# EAGLE design ecg (EAGLE 9.3.0)

## Sheet 1 of 3
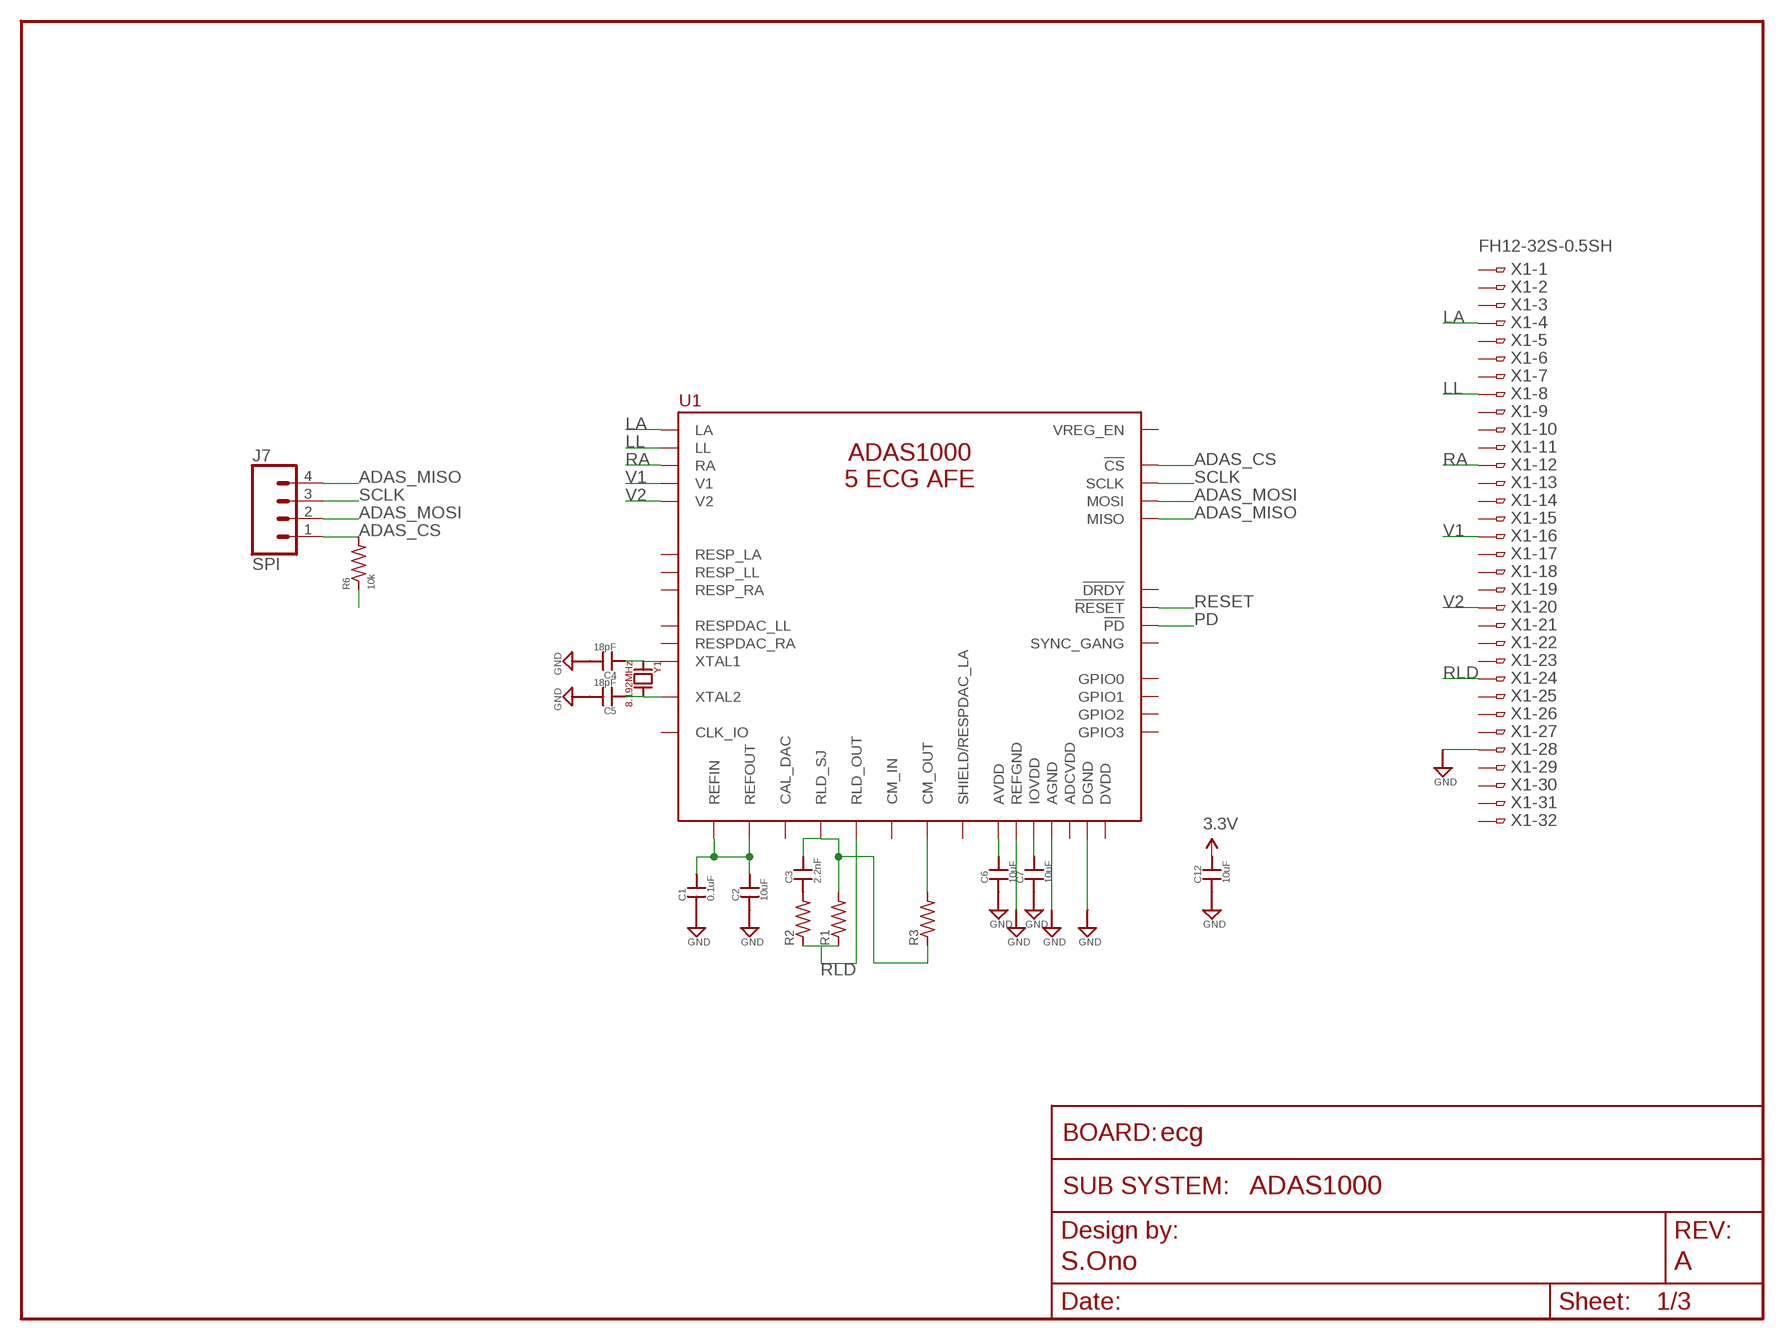
[diagram p0: schematic, sheet 1]
FRAME1 (FRAME_SCHEMATIC): AUTHOR: S.Ono; REV: A; SUBSYSTEM_NAME: ADAS1000

### Parts
C1  0.1uF  CAP0603-CAP  [0603-CAP]
C2  10uF  CAP0603-CAP  [0603-CAP]
C3  2.2nF  CAP0603-CAP  [0603-CAP]
C4  18pF  CAP0603-CAP  [0603-CAP]
C5  18pF  CAP0603-CAP  [0603-CAP]
C6  10uF  CAP0603-CAP  [0603-CAP]
C7  10uF  CAP0603-CAP  [0603-CAP]
C12  10uF  CAP0603-CAP  [0603-CAP]
J7  SPI  CONN_04  [1X04]
R1  4M  R-US_R0603  [R0603]
R2  100k  R-US_R0603  [R0603]
R3  40k  R-US_R0603  [R0603]
R6  10k  R-US_R0603  [R0603]
U1  ADAS1000  [QFP50P1200X1200X160-65N]
X1  FH12-32S-0.5SH  [FH12-32S-0.5SH]
Y1  8.192MHz  CRYSTAL  [HC-49]

### Nets
3.3V: C6.2 C7.2 C12.2 R6.1 U1.18(AVDD) U1.23(AVDD) U1.35(IOVDD) U1.46(IOVDD) U1.58(AVDD) U1.63(AVDD) ; also sheet 2,3
ADAS_CS: J7.1 R6.2 U1.41(!CS) ; also sheet 3
ADAS_MISO: J7.4 U1.45(MISO) ; also sheet 3
ADAS_MOSI: J7.2 U1.43(MOSI) ; also sheet 3
GND: C1.1 C2.1 C4.2 C5.2 C6.1 C7.1 C12.1 U1.2(AGND) U1.7(REFGND) U1.15(AGND) U1.24(AGND) U1.25(AGND) U1.31(DGND) U1.34(DGND) U1.40(DGND) U1.47(DGND) U1.50(DGND) U1.56(AGND) U1.57(AGND) X1.28 ; also sheet 2,3
LA: U1.10(LA) X1.4
LL: U1.11(LL) X1.8
N$1: C1.2 C2.2 U1.8(REFOUT) U1.9(REFIN)
N$3: C3.2 R1.2 R3.1 U1.21(RLD_SJ)
N$4: C3.1 R2.2
N$5: R3.2 U1.22(CM_OUT)
N$6: C4.1 U1.27(XTAL1) Y1.A
N$7: C5.1 U1.28(XTAL2) Y1.B
PD: U1.53(!PD)
RA: U1.12(RA) X1.12
RESET: U1.54(!RESET)
RLD: R1.1 R2.1 U1.20(RLD_OUT) X1.24
SCLK: J7.3 U1.44(SCLK) ; also sheet 3
V1: U1.13(V1) X1.16
V2: U1.14(V2) X1.20
Unconnected: U1.3(RESPDAC_RA) U1.4(RESP_RA) U1.5(RESP_LL) U1.6(RESP_LA) U1.19(CM_IN) U1.26(ADCVDD) U1.29(CLK_IO) U1.30(DVDD) U1.36(GPIO0) U1.37(GPIO1) U1.38(GPIO2) U1.39(GPIO3) U1.42(!DRDY) U1.51(DVDD) U1.52(SYNC_GANG) U1.55(ADCVDD) U1.59(VREG_EN) U1.60(SHIELD/RESPDAC_LA) U1.61(CAL_DAC) U1.62(RESPDAC_LL) X1.1 X1.2 X1.3 X1.5 X1.6 X1.7 X1.9 X1.10 X1.11 X1.13 X1.14 X1.15 X1.17 X1.18 X1.19 X1.21 X1.22 X1.23 X1.25 X1.26 X1.27 X1.29 X1.30 X1.31 X1.32

## Sheet 2 of 3
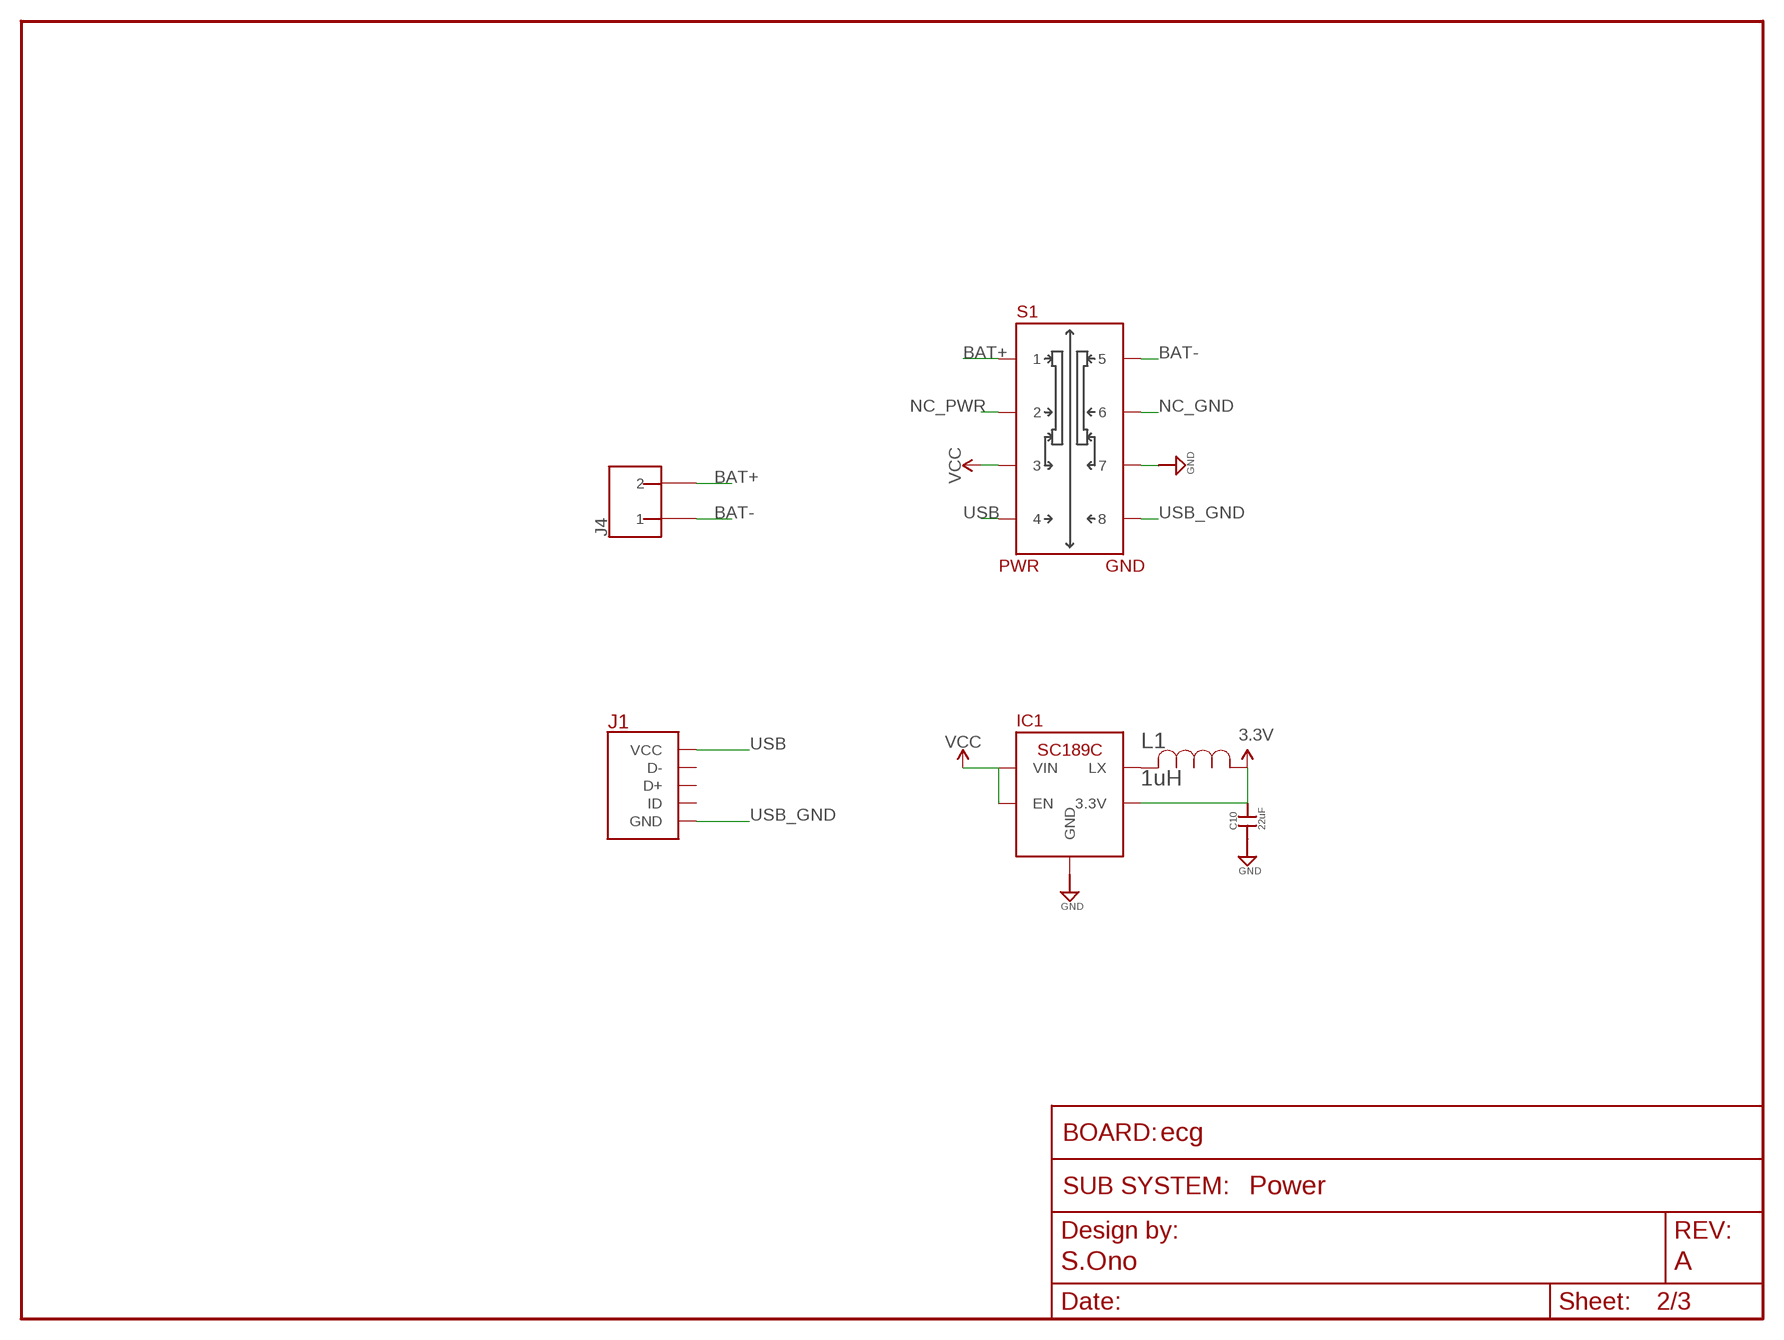
[diagram p1: schematic, sheet 2]
FRAME2 (FRAME_SCHEMATIC): AUTHOR: S.Ono; REV: A; SUBSYSTEM_NAME: Power

### Parts
C10  22uF  CAP0603-CAP  [0603-CAP]
IC1  SC189C  [SOT23-5]
J1  USB_MICRO  [USB_MICRO]
J4  2_PIN_JST-XH  [2_PIN_JST-XH]
L1  1uH  IND  [IND_2012]
S1  DP3T  [DP3T]

### Nets
3.3V: C10.2 IC1.4(3.3V) L1.1 ; also sheet 1,3
BAT+: J4.P$2 S1.1
BAT-: J4.P$1 S1.5
GND: C10.1 IC1.2(GND) S1.7 ; also sheet 1,3
N$2: IC1.5(LX) L1.2
NC_GND: S1.6
NC_PWR: S1.2
USB: J1.VCC S1.4
USB_GND: J1.GND S1.8
VCC: IC1.1(VIN) IC1.3(EN) S1.3
Unconnected: J1.D+ J1.D- J1.ID

### Notes on the sheet
- PWR | GND

## Sheet 3 of 3
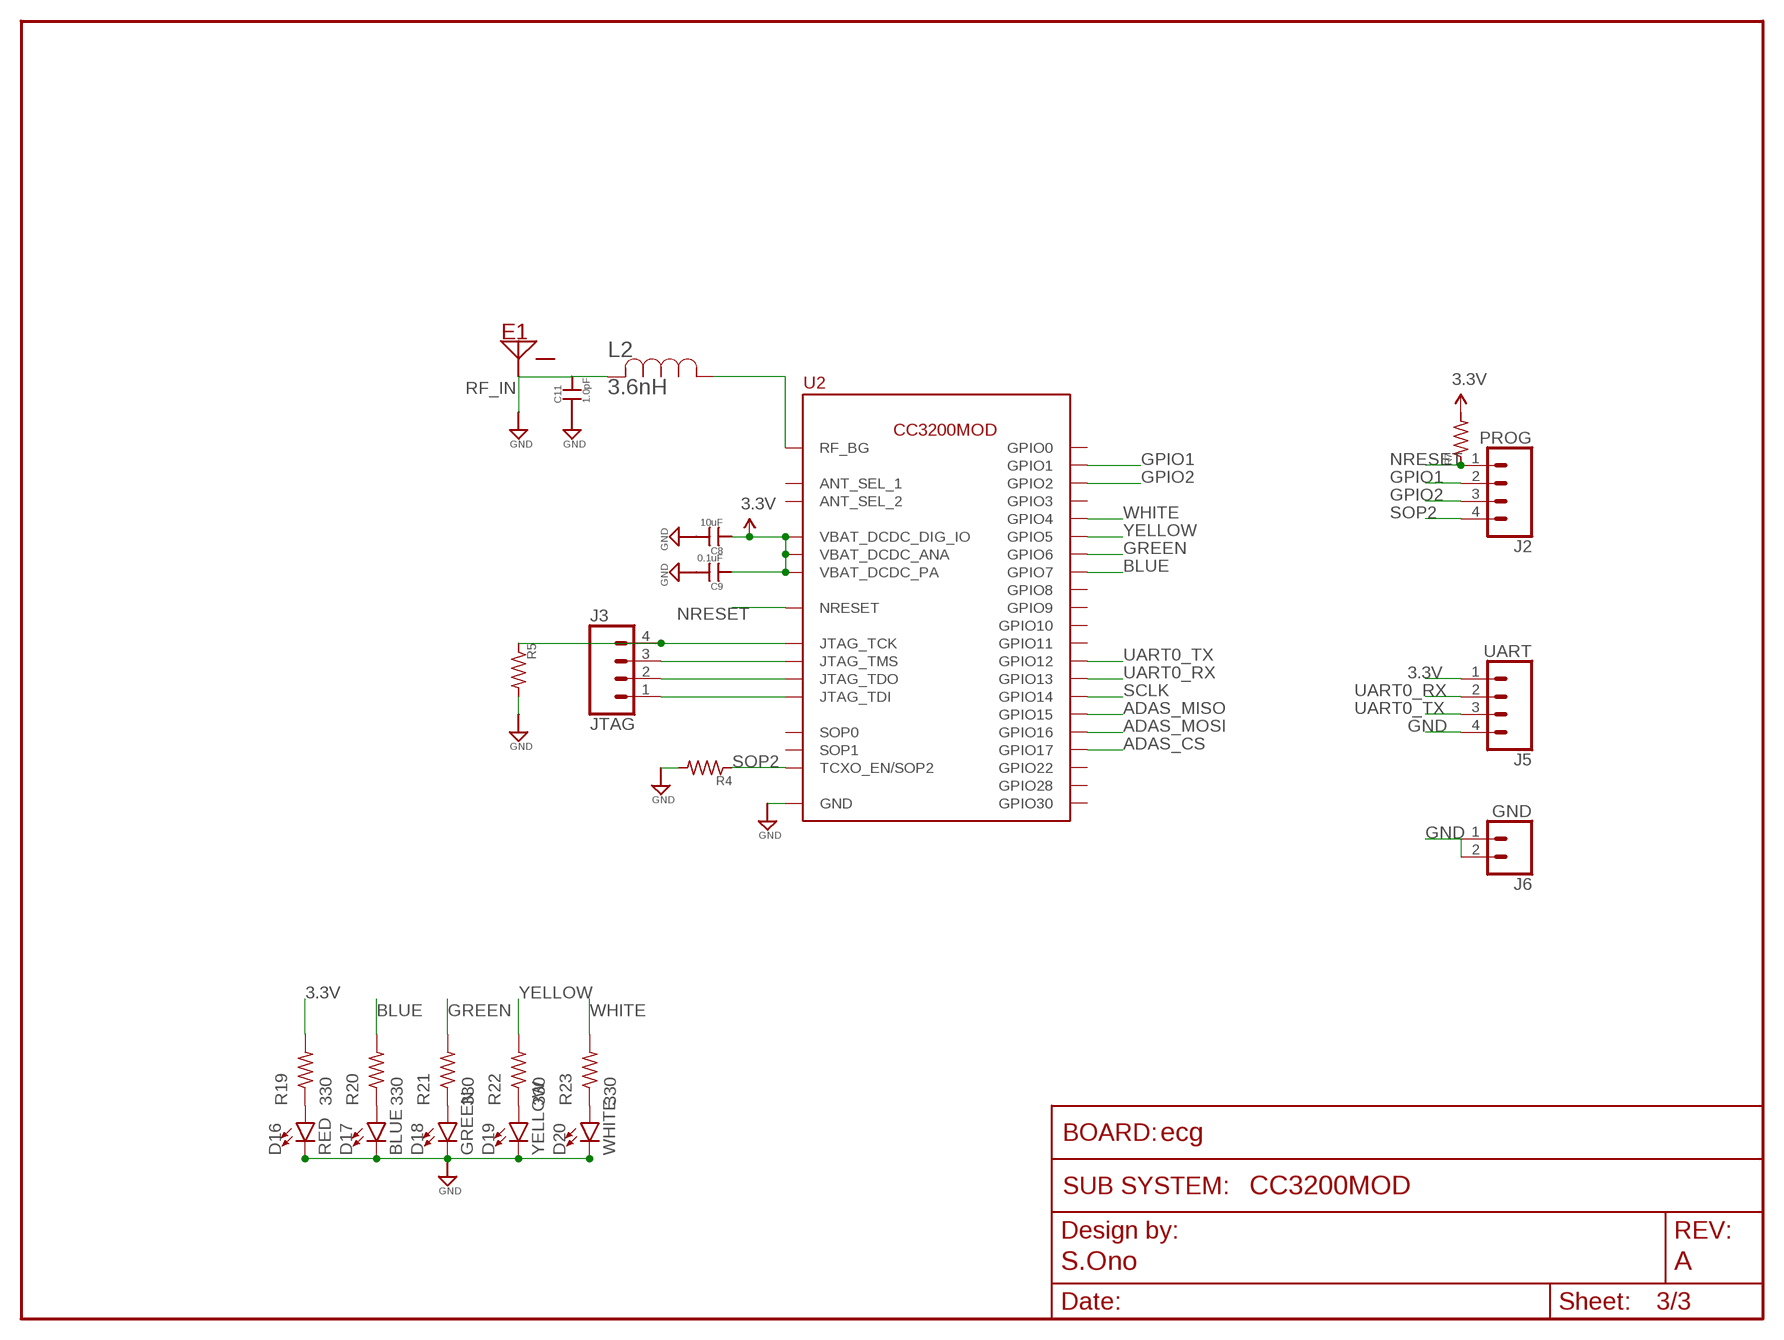
[diagram p2: schematic, sheet 3]
FRAME3 (FRAME_SCHEMATIC): AUTHOR: S.Ono; REV: A; SUBSYSTEM_NAME: CC3200MOD

### Parts
C8  10uF  CAP0603-CAP  [0603-CAP]
C9  0.1uF  CAP0603-CAP  [0603-CAP]
C11  1.0pF  CAP0603-CAP  [0603-CAP]
D16  RED  LED0603  [LED-0603]
D17  BLUE  LED0603  [LED-0603]
D18  GREEN  LED0603  [LED-0603]
D19  YELLOW  LED0603  [LED-0603]
D20  WHITE  LED0603  [LED-0603]
E1  AH316M245001-T  [CHIP_ANT]
J2  PROG  CONN_04  [1X04]
J3  JTAG  CONN_04  [1X04]
J5  UART  CONN_04  [1X04]
J6  GND  CONN_02  [1X02]
L2  3.6nH  IND0402  [IND0402_22N_TAI]
R4  2.7k  R-US_R0603  [R0603]
R5  100k  R-US_R0603  [R0603]
R7  R-US_R0603  [R0603]
R19  330  R-US_R0402  [R0402]
R20  330  R-US_R0402  [R0402]
R21  330  R-US_R0402  [R0402]
R22  330  R-US_R0402  [R0402]
R23  330  R-US_R0402  [R0402]
U2  CC3200MOD  [63-SMD]

### Nets
3.3V: C8.1 C9.1 J5.1 R7.2 R19.2 U2.P$36(VBAT_DCDC_ANA) U2.P$37(VBAT_DCDC_PA) U2.P$40(VBAT_DCDC_DIG_IO) ; also sheet 1,2
ADAS_CS: U2.P$8(GPIO17) ; also sheet 1
ADAS_MISO: U2.P$6(GPIO15) ; also sheet 1
ADAS_MOSI: U2.P$7(GPIO16) ; also sheet 1
BLUE: R20.2 U2.P$52(GPIO7)
GND: C8.2 C9.2 C11.1 D16.C D17.C D18.C D19.C D20.C J5.4 J6.1 J6.2 R4.2 R5.2 U2.P$1(GND) U2.P$2(GND) U2.P$16(GND) U2.P$27(GND) U2.P$28(GND) U2.P$30(GND) U2.P$32(GND) U2.P$38(GND) U2.P$43(GND) U2.P$55(GND) U2.P$56(GND) U2.P$57(GND) U2.P$58(GND) U2.P$59(GND) U2.P$60(GND) U2.P$61(GND) U2.P$62(GND) U2.P$63(GND) ; also sheet 1,2
GPIO1: J2.2 U2.P$46(GPIO1)
GPIO2: J2.3 U2.P$47(GPIO2)
GREEN: R21.2 U2.P$51(GPIO6)
N$8: J3.4 R5.1 U2.P$21(JTAG_TCK)
N$9: J3.3 U2.P$22(JTAG_TMS)
N$10: J3.2 U2.P$18(JTAG_TDO)
N$11: J3.1 U2.P$12(JTAG_TDI)
N$24: D16.A R19.1
N$25: D17.A R20.1
N$26: D18.A R21.1
N$27: D19.A R22.1
N$28: D20.A R23.1
NRESET: J2.1 R7.1 U2.P$35(NRESET)
RF_BG: L2.1 U2.P$31(RF_BG)
RF_IN: C11.2 E1.INPUT L2.2 ; supply symbol labelled GND
SCLK: U2.P$5(GPIO14) ; also sheet 1
SOP2: J2.4 R4.1 U2.P$23(TCXO_EN/SOP2)
UART0_RX: J5.2 U2.P$10(GPIO13)
UART0_TX: J5.3 U2.P$9(GPIO12)
WHITE: R23.2 U2.P$49(GPIO4)
YELLOW: R22.2 U2.P$50(GPIO5)
Unconnected: E1.GND U2.P$3(GPIO10) U2.P$4(GPIO11) U2.P$11(GPIO22) U2.P$19(GPIO28) U2.P$24(SOP1) U2.P$25(ANT_SEL_1) U2.P$26(ANT_SEL_2) U2.P$34(SOP0) U2.P$42(GPIO30) U2.P$44(GPIO0) U2.P$48(GPIO3) U2.P$53(GPIO8) U2.P$54(GPIO9)

## Library data of the parts
C1-C12 = scono:CAP: Capacitor Standard 0603 ceramic capacitor, and 0.1" leaded capacitor.; PIE-INT-REF-NUM: CAPACITOR-GENERIC
D16-D20 = scono:LED: https://www.digikey.com/products/en/optoelectronics/led-indication-discrete/105?k=&pkeyword=&pv7=2&pv1989=0&pv16=5&FV=ffe00069&quantity=0&ColumnSort=0&page=1&pageSize=25
E1 = scono:AH316M245001-T: https://www.digikey.com/product-detail/en/taiyo-yuden/AH316M245001-T/587-2200-1-ND/2002898
IC1 = scono:SC189C: https://www.digikey.com/product-detail/en/semtech-corporation/SC189ZSKTRT/SC189ZSKCT-ND/2182343
J1 = scono:USB_MICRO: https://www.digikey.com/product-detail/en/molex-llc/0475890001/WM17143CT-ND/1832255
J2 J3 J5 J7 = scono:CONN_04: Multi connection point. Often used as Generic Header-pin footprint for 0.1 inch spaced/style header connections On any of the 0.1 inch spaced packages, you can populate with these: Break Away Headers - Straight <https://www.sparkfun.com/products/116> (PRT-00116) Break Away Male Headers - Right Angle <https://www.sparkfun.com/products/553> (PRT-00553) Female Headers <https://www.sparkfun.com/products/115> (PRT-00115) Break Away Headers - Machine Pin <https://www.sparkfun.com/products/117> (PRT-00117) Break Away Female Headers - Swiss Machine Pin <https://www.sparkfun.com/products/743> (PRT-00743) For SCREWTERMINALS and SPRING TERMINALS visit here: Screw Terimnals on SparkFun.com <https://www.sparkfun.com/search/results?term=Screw+Terminals> (5mm/3.5mm/2.54mm spacing) This device is also useful as a general connection point to wire up your design to another part of your project. Our various solder wires solder well into these plated through hole pads. Hook-Up Wire - Assortment (Stranded, 22 AWG) <https://www.sparkfun.com/products/11375> (PRT-11375) Hook-Up Wire - Assortment (Solid Core, 22 AWG) <https://www.sparkfun.com/products/11367> (PRT-11367) View the entire wire category on our website here <https://www.sparkfun.com/categories/141> Special notes: Molex polarized connector foot print use with SKU : PRT-08231 with associated crimp pins and housings. 1MM SMD Version SKU: PRT-10208; PROD_ID: CONN-09696
J4 = scono:2_PIN_JST-XH: https://www.digikey.com/product-detail/en/jst-sales-america-inc/B2B-XH-A(LF)(SN)/455-2247-ND/1651045
J6 = scono:CONN_02: Multi connection point. Often used as Generic Header-pin footprint for 0.1 inch spaced/style header connections On any of the 0.1 inch spaced packages, you can populate with these: Break Away Headers - Straight <https://www.sparkfun.com/products/116> (PRT-00116) Break Away Male Headers - Right Angle <https://www.sparkfun.com/products/553> (PRT-00553) Female Headers <https://www.sparkfun.com/products/115> (PRT-00115) Break Away Headers - Machine Pin <https://www.sparkfun.com/products/117> (PRT-00117) Break Away Female Headers - Swiss Machine Pin <https://www.sparkfun.com/products/743> (PRT-00743) For SCREWTERMINALS and SPRING TERMINALS visit here: Screw Terimnals on SparkFun.com <https://www.sparkfun.com/search/results?term=Screw+Terminals> (5mm/3.5mm/2.54mm spacing) This device is also useful as a general connection point to wire up your design to another part of your project. Our various solder wires solder well into these plated through hole pads. Hook-Up Wire - Assortment (Stranded, 22 AWG) <https://www.sparkfun.com/products/11375> (PRT-11375) Hook-Up Wire - Assortment (Solid Core, 22 AWG) <https://www.sparkfun.com/products/11367> (PRT-11367) View the entire wire category on our website here <https://www.sparkfun.com/categories/141> Special notes: Molex polarized connector foot print use with: PRT-08233 with associated crimp pins and housings. 2.54_SCREWTERM for use with PRT-10571. 3.5mm Screw Terminal footprints for PRT-08084 5mm Screw Terminal footprints for use with PRT-08432
L1 = scono:IND; MANUFACTURER_PART_NUMBER: MLZ2012M1R0HT000; VENDOR: TDK
L2 = scono:IND
R1-R7 = scono:R-US_: RESISTOR, American symbol; DESCRIPTION: RESISTOR, American symbol; DISTRIBUTOR: DigiKey; MANUFACTURER: Rohm Semiconductor; NOTES: Cut Tape; PACKAGE: R0603
R19-R23 = BEST_Custom:R-US_: RESISTOR, American symbol; PIE-INT-REF-NUM: RESISTOR-GENERIC
S1 = scono:DP3T: https://www.digikey.com/product-detail/en/c-k/JS203011JCQN/CKN10725CT-ND/6137639
U1 = scono:ADAS1000: http://www.analog.com/media/en/reference-design-documentation/reference-designs/CN0308.pdf
U2 = scono:CC3200MOD: https://www.digikey.com/product-detail/en/CC3200MODR1M2AMOBT/296-43564-1-ND/5864711?utm_campaign=buynow&WT.z_cid=ref_octopart_dkc_buynow&utm_medium=aggregator&curr=usd&site=us&utm_source=octopart
X1 = scono:FH12-32S-0.5S: 0.5mm Pitch Connectors For FPC/FFC Source: Data sheet <http://www.hirose.co.jp/cataloge_hp/e58605370.pdf>; OC_FARNELL: unknown; OC_NEWARK: unknown
Y1 = scono:CRYSTAL

## Board
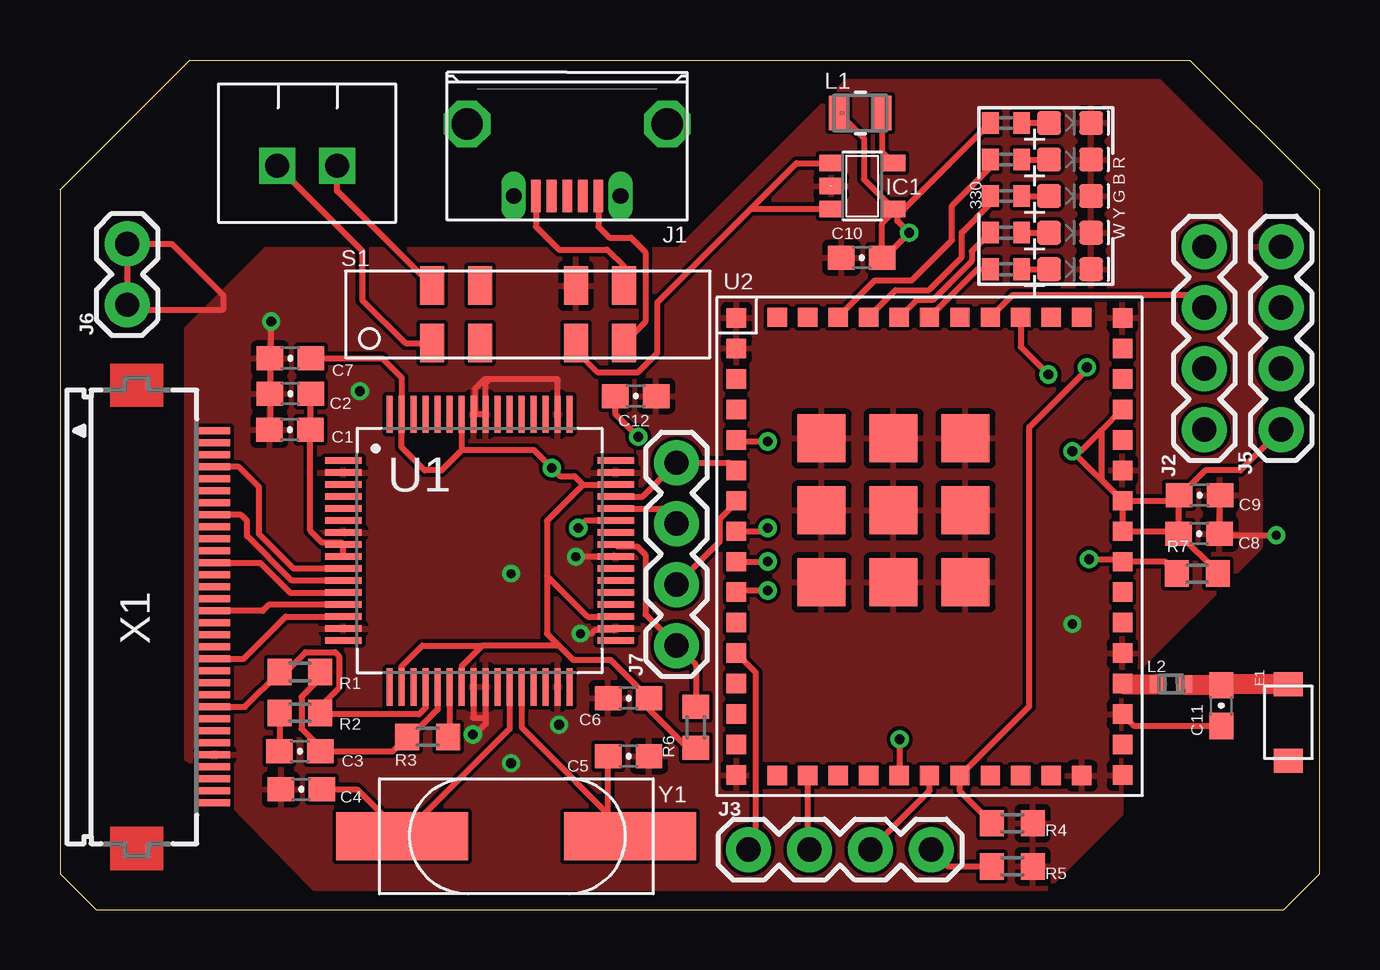
[diagram p3: board, top side]
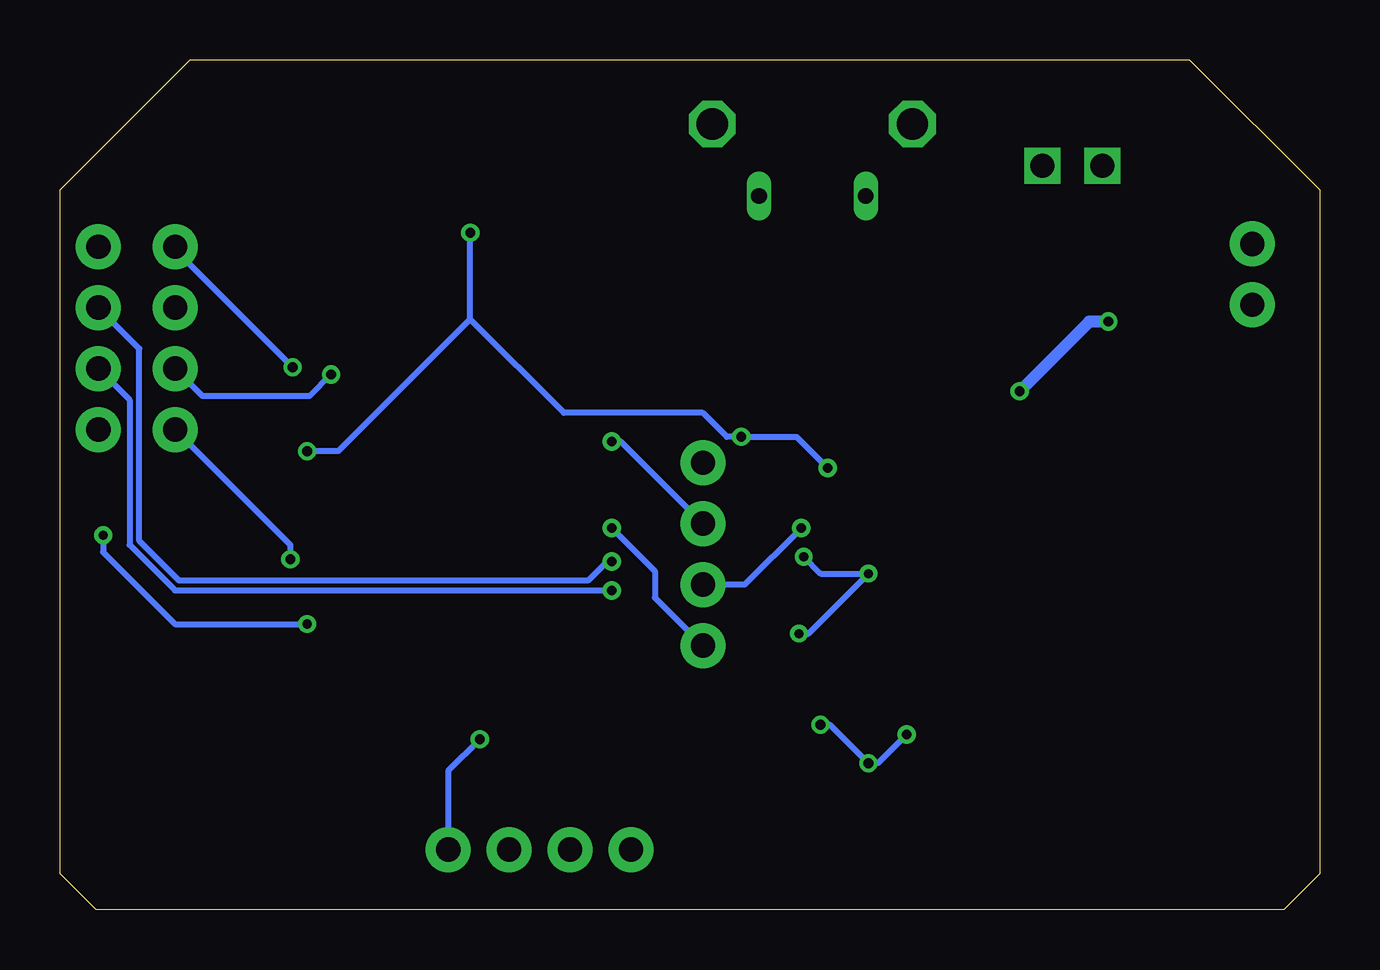
[diagram p4: board, bottom side, seen from below]

Size 52.5 x 35.4 mm. Coordinates in mm from the lower left corner, seen from the top.
Outline: 0,1.5 1.5,0 51,0 52.5,1.5 52.5,30 47.1,35.4 5.4,35.4 0,30 0,1.5
Copper layers (1+16): Top 2mil / dielectric 9mil / Bottom 2mil
Design rules "squishy *": minimum track width 6mil, minimum drill 15mil, track to track 6mil, track to pad 6mil, pad to pad 6mil, via to via 6mil, smd to smd 6mil, copper to edge 25mil, drill to drill 7mil, minimum pad ring 7mil, minimum via ring 7mil, stop-mask expansion 3mil, vias tented up to drill 0mil, thermal gap 10mil

### Footprints (pad centres in the part's own frame; a part is rotated, then mirrored left to right if it is on the bottom)
0603-CAP = smd 1.1 x 1: 1 -0.85,0; 2 0.85,0
LED-0603 = smd 1 x 1: A -0.877,0; C 0.877,0
CHIP_ANT = smd 1 x 1.2: GND 1.6,0; INPUT -1.6,0
SOT23-5 = smd 0.69 x 0.99: 1 -0.95,-1.29; 2 0,-1.29; 3 0.95,-1.29; 4 0.95,1.3; 5 -0.95,1.3
USB_MICRO = smd 0.4 x 1.35: D+ 0,3; D- -0.65,3; GND 1.3,3; ID 0.65,3; VCC -1.3,3 | drill 1.3 octagon: P$1 -4.175,0; P$2 4.175,0 | drill 0.65 pad 1.016 long: P$3 -2.225,3; P$4 2.225,3
1X04 = drill 1.016 pad 1.88: 1 0,0; 2 2.54,0; 3 5.08,0; 4 7.62,0
2_PIN_JST-XH = drill 1 square: P$1 2.45,3.4; P$2 4.95,3.4
1X02 = drill 1.016 pad 1.88: 1 0,0; 2 2.54,0
IND_2012 = smd 0.803 x 1.45: 1 -0.902,0; 2 0.902,0
IND0402_22N_TAI = smd 0.61 x 0.711: 1 -0.572,0; 2 0.572,0
R0603 = smd 1 x 1.1: 1 -0.85,0; 2 0.85,0
R0402 = smd 0.7 x 0.9: 1 -0.65,0; 2 0.65,0
DP3T = smd 1 x 1.6: 1 -4,-1.2; 2 -2,-1.2; 3 2,-1.2; 4 4,-1.2; 5 -4,1.2; 6 -2,1.2; 7 2,1.2; 8 4,1.2
QFP50P1200X1200X160-65N = smd 1.56 x 0.28: 1 -5.68,3.75; 2 -5.68,3.25; 3 -5.68,2.75; 4 -5.68,2.25; 5 -5.68,1.75; 6 -5.68,1.25; 7 -5.68,0.75; 8 -5.68,0.25; 9 -5.68,-0.25; 10 -5.68,-0.75; 11 -5.68,-1.25; 12 -5.68,-1.75; 13 -5.68,-2.25; 14 -5.68,-2.75; 15 -5.68,-3.25; 16 -5.68,-3.75; 33 5.68,-3.75; 34 5.68,-3.25; 35 5.68,-2.75; 36 5.68,-2.25; 37 5.68,-1.75; 38 5.68,-1.25; 39 5.68,-0.75; 40 5.68,-0.25; 41 5.68,0.25; 42 5.68,0.75; 43 5.68,1.25; 44 5.68,1.75; 45 5.68,2.25; 46 5.68,2.75; 47 5.68,3.25; 48 5.68,3.75 | smd 0.28 x 1.56: 17 -3.75,-5.68; 18 -3.25,-5.68; 19 -2.75,-5.68; 20 -2.25,-5.68; 21 -1.75,-5.68; 22 -1.25,-5.68; 23 -0.75,-5.68; 24 -0.25,-5.68; 25 0.25,-5.68; 26 0.75,-5.68; 27 1.25,-5.68; 28 1.75,-5.68; 29 2.25,-5.68; 30 2.75,-5.68; 31 3.25,-5.68; 32 3.75,-5.68; 49 3.75,5.68; 50 3.25,5.68; 51 2.75,5.68; 52 2.25,5.68; 53 1.75,5.68; 54 1.25,5.68; 55 0.75,5.68; 56 0.25,5.68; 57 -0.25,5.68; 58 -0.75,5.68; 59 -1.25,5.68; 60 -1.75,5.68; 61 -2.25,5.68; 62 -2.75,5.68; 63 -3.25,5.68; 64 -3.75,5.68
63-SMD = smd 0.81 x 0.81: P$1 -8.05,9.525; P$2 -8.05,8.255; P$3 -8.05,6.985; P$4 -8.05,5.715; P$5 -8.05,4.445; P$6 -8.05,3.175; P$7 -8.05,1.905; P$8 -8.05,0.635; P$9 -8.05,-0.635; P$10 -8.05,-1.905; P$11 -8.05,-3.175; P$12 -8.05,-4.445; P$13 -8.05,-5.715; P$14 -8.05,-6.985; P$15 -8.05,-8.255; P$16 -8.05,-9.525; P$17 -6.35,-9.55; P$18 -5.08,-9.55; P$19 -3.81,-9.55; P$20 -2.54,-9.55; P$21 -1.27,-9.55; P$22 0,-9.55; P$23 1.27,-9.55; P$24 2.54,-9.55; P$25 3.81,-9.55; P$26 5.08,-9.55; P$27 6.35,-9.55; P$28 8.05,-9.525; P$29 8.05,-8.255; P$30 8.05,-6.985; P$31 8.05,-5.715; P$32 8.05,-4.445; P$33 8.05,-3.175; P$34 8.05,-1.905; P$35 8.05,-0.635; P$36 8.05,0.635; P$37 8.05,1.905; P$38 8.05,3.175; P$39 8.05,4.445; P$40 8.05,5.715; P$41 8.05,6.985; P$42 8.05,8.255; P$43 8.05,9.525; P$44 6.35,9.55; P$45 5.08,9.55; P$46 3.81,9.55; P$47 2.54,9.55; P$48 1.27,9.55; P$49 0,9.55; P$50 -1.27,9.55; P$51 -2.54,9.55; P$52 -3.81,9.55; P$53 -5.08,9.55; P$54 -6.35,9.55 | smd 2 x 2: P$55 -4.5,4.5; P$56 -4.5,1.5; P$57 -4.5,-1.5; P$58 -1.5,4.5; P$59 -1.5,1.5; P$60 -1.5,-1.5; P$61 1.5,4.5; P$62 1.5,1.5; P$63 1.5,-1.5
FH12-32S-0.5SH = smd 0.3 x 1.3: 1 -7.75,3.25; 2 -7.25,3.25; 3 -6.75,3.25; 4 -6.25,3.25; 5 -5.75,3.25; 6 -5.25,3.25; 7 -4.75,3.25; 8 -4.25,3.25; 9 -3.75,3.25; 10 -3.25,3.25; 11 -2.75,3.25; 12 -2.25,3.25; 13 -1.75,3.25; 14 -1.25,3.25; 15 -0.75,3.25; 16 -0.25,3.25; 17 0.25,3.25; 18 0.75,3.25; 19 1.25,3.25; 20 1.75,3.25; 21 2.25,3.25; 22 2.75,3.25; 23 3.25,3.25; 24 3.75,3.25; 25 4.25,3.25; 26 4.75,3.25; 27 5.25,3.25; 28 5.75,3.25; 29 6.25,3.25; 30 6.75,3.25; 31 7.25,3.25; 32 7.75,3.25
HC-49 = smd 5.5 x 2: A 4.75,0; B -4.75,0

### Placement (x,y rotation side)
C1  9.58,19.99 0 top
C2  9.6,21.49 0 top
C3  10,6.59 0 top
C4  10.06,5.01 180 top
C5  23.7,6.39 0 top
C6  23.7,8.81 0 top
C7  9.6,22.97 0 top
C8  47.48,15.67 0 top
C9  47.5,17.27 0 top
C10  33.42,27.17 0 top
C11  48.4,8.5 90 top
C12  24,21.4 180 top
D16  42.1,32.78 0 top
D17  42.1,31.25 0 top
D18  42.1,29.73 0 top
D19  42.1,28.21 0 top
D20  42.1,26.68 0 top
E1  51.2,7.8 270 top
IC1  33.44,30.15 270 top
J1  21.14,32.73 180 top
J2  47.7,20 90 top
J3  28.7,2.5 0 top
J4  14,34.4 180 top
J5  50.9,20 90 top
J6  2.8,25.2 90 top
J7  25.7,11 90 top
L1  33.36,33.19 0 top
L2  46.3,9.4 0 top
R1  10,9.9 0 top
R2  10,8.2 180 top
R3  15.32,7.2 0 top
R4  39.7,3.6 0 top
R5  39.7,1.8 0 top
R6  26.5,7.6 90 top
R7  47.4,14 0 top
R19  39.44,32.78 180 top
R20  39.44,31.25 180 top
R21  39.44,29.73 180 top
R22  39.44,28.21 180 top
R23  39.44,26.68 180 top
S1  19.5,24.8 0 top
U1  17.49,14.96 0 top
U2  36.24,15.13 0 top
X1  3.2,12.2 270 top
Y1  19.02,3.06 180 top

### Tracks (layer width: path | path; a pad name or v marks a point on that pad's centre or on a via)
3.3V  (via drill 0.41)
  Top 0.254: L1.1 33.5,32.15 33.5,30.44 IC1.4 34.9,29.2 | R19.2 35.21,29.2 34.9,29.2 | 34.9,29.2 34.27,28.57 C10.2 34.42,27.02 34.42,27.22 v35.4,28.2 34.9,28.7 34.9,29.2 | C7.2 13.43,22.97 14.24,22.16 U1.63 14.24,19.26 15.2,18.3 15.9,18.3 16.74,19.14 | U1.58 16.74,19.14 | 21.8,17.7 21.44,18.06 20.84,18.06 v20.5,18.4 19.76,19.14 16.74,19.14 | 21.8,17.7 21.81,17.71 U1.46 | U1.35 21.99,12.21 20.3,13.9 | 20.79,11.01 20.78,11 17.6,11 | 17.6,11 16.74,10.14 U1.23 | U1.18 14.24,10.14 15.1,11 17.6,11 | U2.P$36 44.5,15.77 | 44.5,15.77 46.53,15.77 C8.1 | C8.1 46.63,17.2 | 46.63,17.2 46.63,17.25 C9.1 | U2.P$37 44.29,15.97 44.5,15.77 | U2.P$37 46.47,17.04 46.63,17.2 | U2.P$40 43.4,19.95 | 44.21,17.11 43.4,17.93 43.4,19.95 | 44.21,17.11 U2.P$37 | 43.4,19.95 42.55,19.1 v42.2,19.1 44.19,17.11 44.21,17.11 | v24.1,19.7 23.15,20.65 C12.2 | J5.1 49.2,18.3 47.73,18.3 46.63,17.2 | 21.8,17.7 20.3,16.2 20.3,13.9 | 20.79,11.01 21.4,10.4 22.96,10.4 C6.2 24.55,8.35 26.15,6.75 R6.1 | 20.3,13.9 20.3,11.5 20.79,11.01 | C8.1 48.25,14.05 R7.2
  Bottom 0.254: 35.4,24.6 40.9,19.1 v42.2,19.1 | v20.5,18.4 21.8,19.7 v24.1,19.7 24.7,19.7 25.7,20.7 31.5,20.7 35.4,24.6 | 35.4,24.6 v35.4,28.2
ADAS_CS  (via drill 0.41)
  Top 0.254: U2.P$8 29.36,15.77 v29.5,15.9 | U1.41 23.25,15.13 24.05,15.13 24.4,14.78 24.4,12.3 J7.1 26.5,10.2 R6.2
  Bottom 0.254: v29.5,15.9 27.7,14.1 27.7,13 J7.1
ADAS_MISO
  Top 0.254: U1.45 24.29,17.21 J7.4 27.88,18.62 U2.P$6
ADAS_MOSI  (via drill 0.41)
  Top 0.254: J7.2 27.51,15.35 27.51,16.29 28.19,16.97 U2.P$7 | U1.43 21.91,16.21 v21.6,15.9
  Bottom 0.254: v21.6,15.9 23.96,13.54 J7.2
BAT+
  Top 0.254: J4.P$2 12.6,27.45 12.6,25.4 14.4,23.6 S1.1
BAT-
  Top 0.254: S1.5 11.55,29.95 J4.P$1
BLUE
  Top 0.254: U2.P$52 33.96,26.21 35.5,26.21 37.19,27.9 37.19,29.33 38.78,30.93 R20.2
GND  (via drill 0.38, 0.41)
  Top 0.254: U1.25 17.74,8 | 17.74,8 17.74,7.74 17.3,7.3 v17.2,7.3 | U1.24 17.24,8.04 17.2,8 17.74,8 | 17.3,20.64 U1.56 17.74,21.94 17.9,22.1 | 17.3,20.64 U1.57 | U1.50 20.74,22.06 20.7,22.1 17.9,22.1 | 17.9,22.1 17.7,22.1 17.3,21.7 17.3,20.64 | v8.8,24.5 8.8,23.02 C7.1 C2.1 8.75,20.01 C1.1 | C11.1 44.78,7.65 U2.P$30 | U1.40 v21.51,14.71 v21.5,14.7 | U1.34 23.09,11.63 22.29,11.63 22.16,11.5 v21.7,11.5 | v50.7,15.6 48.4,15.6 C8.2 48.33,17.25 C9.2 | J6.2 J6.1 3,25 6.8,25 6.8,25.6 4.66,27.74 J6.2
  Bottom 0.254: v17.2,7.3 18.4,6.1 v18.8,6.1 20.4,7.7 v20.8,7.7 | v21.5,14.7 20.8,14 v18.8,14 21.3,11.5 v21.7,11.5 | v50.7,15.6 50.7,14.9 47.7,11.9 v42.2,11.9
  Bottom 0.508: v8.8,24.5 9.6,24.5 v12.5,21.6
  pour Top: 8.6,27.5 25.8,27.5 32.8,34.5 45.8,34.5 50,30.3 50,15.1 44.2,9.3 44.2,4 41.1,0.9 10.6,0.9 5.3,6.3 5.3,24.2
GPIO1  (via drill 0.41)
  Top 0.254: U2.P$46 40.05,23.45 v41.2,22.3
  Bottom 0.254: v41.2,22.3 42.1,21.4 46.56,21.4 J2.2
GPIO2
  Top 0.254: J2.3 47.18,25.6 39.7,25.6 U2.P$47
GREEN
  Top 0.254: U2.P$51 34.83,25.81 36.22,25.81 36.76,26.34 37.59,27.18 37.59,28.21 38.78,29.4 R21.2
LA
  Top 0.254: U1.10 9.74,14.21 8.3,15.65 8.3,17.6 7.45,18.45 X1.4
LL
  Top 0.254: U1.11 9.66,13.71 7.8,15.57 7.8,16.2 7.55,16.45 X1.8
N$1
  Top 0.254: U1.9 U1.8 11.73,15.29 10.93,15.29 10.43,15.79 C1.2 10.45,20.01 C2.2
N$2
  Top 0.254: L1.2 34.26,31.58 IC1.5
N$3
  Top 0.254: U1.21 15.74,8.34 14.6,7.2 R3.1 13.86,6.59 C3.2 10.85,6.75 10.07,7.53 10.07,8.87 10.85,9.64 R1.2
N$4
  Top 0.254: R2.2 C3.1
N$5
  Top 0.254: U1.22 16.24,7.27 R3.2
N$6
  Top 0.254: U1.27 18.74,7.53 14.3,3.1 | 14.3,3.1 Y1.A | C4.1 12.39,5.01 14.3,3.1
N$7
  Top 0.254: U1.28 19.24,7.59 Y1.B 22.85,3.98 C5.1
N$8  (via drill 0.41)
  Top 0.254: U2.P$21 35,5.61 v35,7.1 | J3.4 37.02,1.8 R5.1
  Bottom 0.254: v35,7.1 36.32,5.78 J3.4
N$9
  Top 0.254: J3.3 36.24,4.96 U2.P$22
N$10
  Top 0.254: U2.P$18 31.16,2.58 J3.2
N$11
  Top 0.254: J3.1 29,2.8 29,9.88 U2.P$12
N$24
  Top 0.254: R19.1 D16.A
N$25
  Top 0.254: R20.1 D17.A
N$26
  Top 0.254: R21.1 D18.A
N$27
  Top 0.254: R22.1 D19.A
N$28
  Top 0.254: R23.1 D20.A
NRESET  (via drill 0.41)
  Top 0.254: v42.9,14.6 44.19,14.6 U2.P$35 46.05,14.49 R7.1
  Bottom 0.254: J2.1 42.9,15.2 v42.9,14.6
RA
  Top 0.254: X1.12 8.35,14.45 9.59,13.21 U1.12
RF_BG
  Top 0.254: U2.P$31 44.3,9.4
  Top 0.838: 44.3,9.4 L2.1
RF_IN
  Top 0.254: 48.45,9.4 C11.2 | 46.92,9.35 L2.2
  Top 0.838: E1.INPUT 48.45,9.4 | C11.2 46.92,9.35
RLD
  Top 0.254: U1.20 15.24,8.41 14.96,8.14 10.91,8.14 R2.1 10.85,8.46 11.63,9.23 11.63,10.57 11.47,10.73 10.23,10.73 9.4,9.9 R1.1 7.7,8.45 X1.24
SCLK  (via drill 0.41)
  Top 0.254: U1.44 25.07,16.71 J7.3 | v29.5,19.5 28.27,19.5 U2.P$5
  Bottom 0.254: J7.3 29.12,19.5 v29.5,19.5
SOP2  (via drill 0.41)
  Top 0.254: v42.8,22.6 42.8,22.5 40.4,20.1 40.4,8.47 U2.P$23 37.51,4.94 R4.1
  Bottom 0.254: J2.4 47.7,27.5 v42.8,22.6
UART0_RX  (via drill 0.41)
  Top 0.254: U2.P$10 28.27,13.3 v29.5,13.3
  Bottom 0.254: v29.5,13.3 47.7,13.3 49.6,15.2 49.6,21.24 J5.2
UART0_TX  (via drill 0.41)
  Top 0.254: U2.P$9 v29.5,14.5
  Bottom 0.254: v29.5,14.5 29.7,14.5 30.49,13.71 47.53,13.71 49.19,15.37 49.19,23.37 J5.3
USB
  Top 0.254: J1.VCC 22.44,28.46 22.9,28 23.8,28 24.4,27.4 24.4,24.5 S1.4
USB_GND
  Top 0.254: J1.GND 19.84,28.46 20.8,27.5 22.8,27.5 23.5,26.8 S1.8
V1
  Top 0.254: U1.13 8.7,12.7 8.45,12.45 X1.16
V2
  Top 0.254: X1.20 7.65,10.45 9.41,12.21 U1.14
VCC
  Top 0.254: S1.3 21.5,23.3 22.4,22.4 24.1,22.4 24.9,23.2 24.9,25.3 28.8,29.2 | 28.8,29.2 IC1.3 | 28.8,29.2 30.7,31.1 IC1.1
WHITE
  Top 0.254: U2.P$49 38.24,26.68 R23.2
YELLOW
  Top 0.254: R22.2 38,27.42 38,27.02 36.38,25.4 35.69,25.4 U2.P$50

### Text on the board
tPlace: W Y G B R | 330